# Altium schematic sheet STM32G473CET6_PINOUT.SchDoc
size C; SheetNumber: 9; SheetTotal: 12
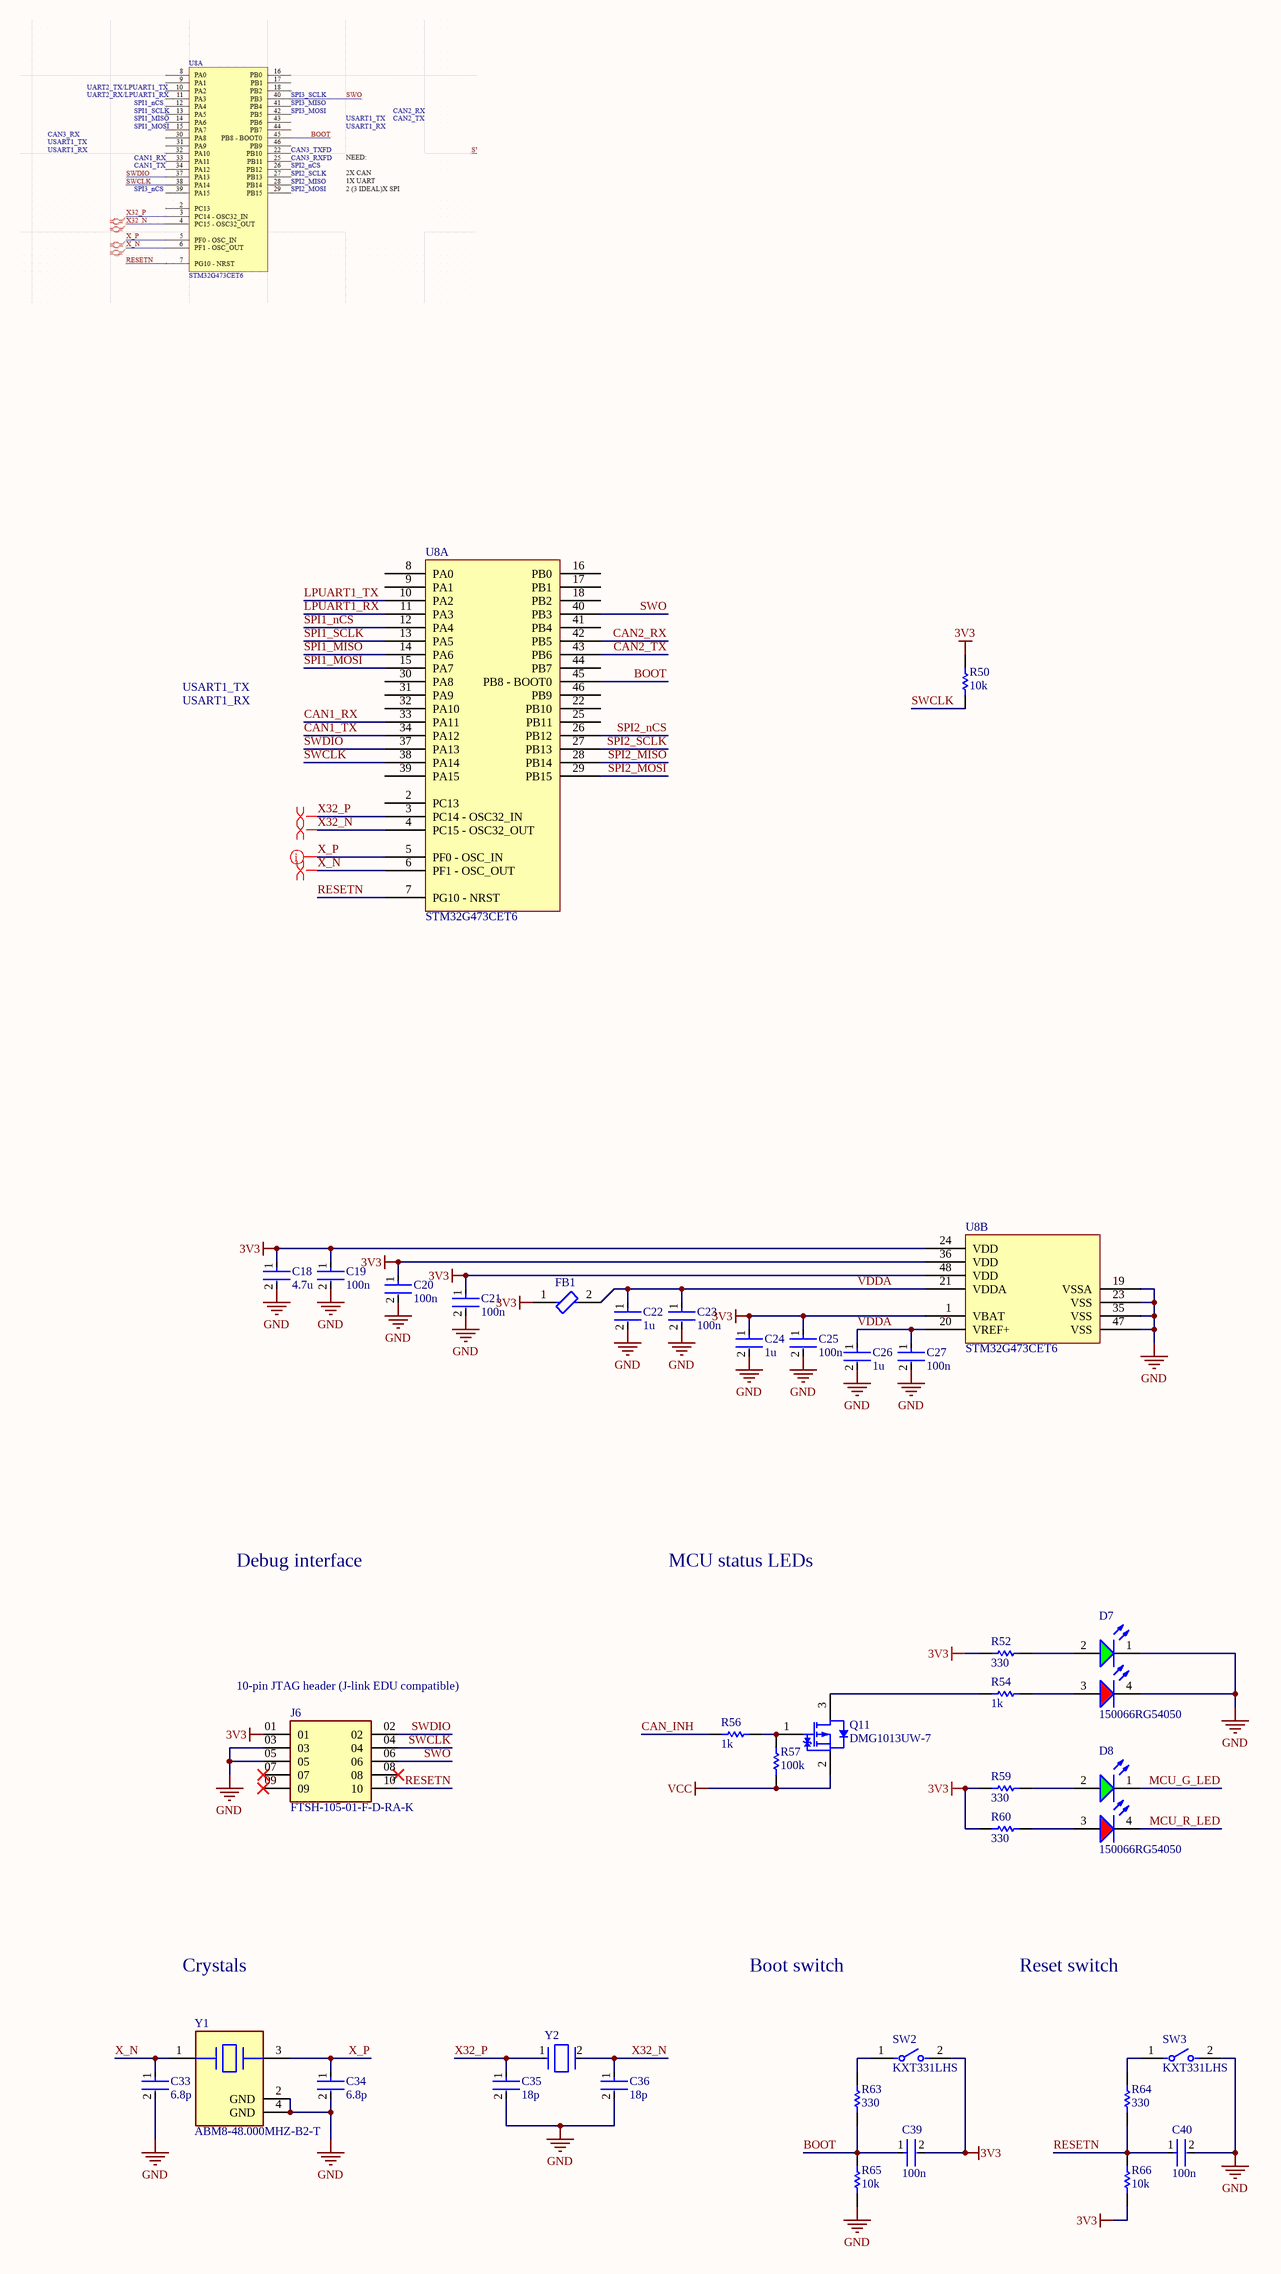
[diagram p0: STM32G473CET6_PINOUT.SchDoc]

## Parts
C18  4.7u  [FP-0402-L_1_0_0_05-W_0_5-IPC_A]
C19  100n  [FP-0402-L_1_0_0_05-W_0_5-IPC_A]
C20  100n  [FP-0402-L_1_0_0_05-W_0_5-IPC_A]
C21  100n  [FP-0402-L_1_0_0_05-W_0_5-IPC_A]
C22  1u  [FP-0402-L_1_0_0_05-W_0_5-IPC_A]
C23  100n  [FP-0402-L_1_0_0_05-W_0_5-IPC_A]
C24  1u  [FP-0402-L_1_0_0_05-W_0_5-IPC_A]
C25  100n  [FP-0402-L_1_0_0_05-W_0_5-IPC_A]
C26  1u  [FP-0402-L_1_0_0_05-W_0_5-IPC_A]
C27  100n  [FP-0402-L_1_0_0_05-W_0_5-IPC_A]
C33  6.8p  [FP-0402-L_1_0_0_05-W_0_5-IPC_A]
C34  6.8p  [FP-0402-L_1_0_0_05-W_0_5-IPC_A]
C35  18p  [FP-0402-L_1_0_0_05-W_0_5-IPC_A]
C36  18p  [FP-0402-L_1_0_0_05-W_0_5-IPC_A]
C39  100n  [FP-0402-L_1_0_0_05-W_0_5-IPC_A]
C40  100n  [FP-0402-L_1_0_0_05-W_0_5-IPC_A]
D7  150066RG54050  [WL-SBCD_0606]
D8  150066RG54050  [WL-SBCD_0606]
FB1  BLM15PX601SN1D  [FP-BLM15-0_05-MFG]  (value not drawn)
J6  FTSH-105-01-F-D-RA-K  [FTSH-105-01-F-D-RA-K-Footprint-1]
Q11  DMG1013UW-7  [DIOD-SOT323-3_V]
R50  10k  [R0603B]
R52  330  [R0603B]
R54  1k  [R0603B]
R56  1k  [R0603B]
R57  100k  [R0603B]
R59  330  [R0603B]
R60  330  [R0603B]
R63  330  [R0603B]
R64  330  [R0603B]
R65  10k  [R0603B]
R66  10k  [R0603B]
SW2  KXT331LHS  [FP-KXT331LHS-MFG]
SW3  KXT331LHS  [FP-KXT331LHS-MFG]
U8  STM32G473CET6  [TSQFP50P900X900X160-48N]  (parts A,B of 2)
Y1  ABM8-48.000MHZ-B2-T  [FP-ABM8-MFG]
Y2  ECS-.327-12.5-1210-TR  [FP-ECX-1210-MFG]  (value not drawn)

## Nets
3V3: C18.1 C19.1 C20.1 C21.1 C24.1 C25.1 C39.2 FB1.1 J6.01 R50.2 R52.2 R59.2 R60.2 R66.1 SW2.2 U8.1(VBAT) U8.24(VDD) U8.36(VDD) U8.48(VDD)
GND: C18.2 C19.2 C20.2 C21.2 C22.2 C23.2 C24.2 C25.2 C26.2 C27.2 C33.2 C34.2 C35.2 C36.2 C40.2 D7.1(K) D7.4(K) J6.03 J6.05 R65.1 SW3.2 U8.19(VSSA) U8.23(VSS) U8.35(VSS) U8.47(VSS) Y1.2(GND) Y1.4(GND)
VCC: Q11.2(S) R57.2
BOOT: C39.1 R63.1 R65.2 U8.45(PB8_-_BOOT0)
CAN1_RX: U8.33(PA11)
CAN1_TX: U8.34(PA12)
CAN2_RX: U8.42(PB5)
CAN2_TX: U8.43(PB6)
CAN_INH: R56.2
LPUART1_RX: U8.11(PA3)
LPUART1_TX: U8.10(PA2)
MCU_G_LED: D8.1(K)
MCU_R_LED: D8.4(K)
RESETN: C40.1 J6.10 R64.1 R66.2 U8.7(PG10_-_NRST)
SPI1_MISO: U8.14(PA6)
SPI1_MOSI: U8.15(PA7)
SPI1_nCS: U8.12(PA4)
SPI1_SCLK: U8.13(PA5)
SPI2_MISO: U8.28(PB14)
SPI2_MOSI: U8.29(PB15)
SPI2_nCS: U8.26(PB12)
SPI2_SCLK: U8.27(PB13)
SWCLK: J6.04 R50.1 U8.38(PA14)
SWDIO: J6.02 U8.37(PA13)
SWO: J6.06 U8.40(PB3)
VDDA: C22.1 C23.1 C26.1 C27.1 FB1.2 U8.20(VREF+) U8.21(VDDA)
X32_N: C36.1 U8.4(PC15_-_OSC32_OUT) Y2.2(Out/In)
X32_P: C35.1 U8.3(PC14_-_OSC32_IN) Y2.1(In/Out)
X_N: C33.1 U8.6(PF1_-_OSC_OUT) Y1.1
X_P: C34.1 U8.5(PF0_-_OSC_IN) Y1.3
NetD7_2: D7.2(A) R52.1
NetD7_3: D7.3(A) R54.1
NetD8_2: D8.2(A) R59.1
NetD8_3: D8.3(A) R60.1
NetQ11_1: Q11.1(G) R56.1 R57.1
NetQ11_3: Q11.3(D) R54.2
NetR63_2: R63.2 SW2.1
NetR64_2: R64.2 SW3.1

Not connected (* = marked no-connect by the designer): J6 07* 08* 09*; U8 2(PC13) 8(PA0) 9(PA1) 16(PB0) 17(PB1) 18(PB2) 22(PB10) 25(PB11) 30(PA8) 31(PA9) 32(PA10) 39(PA15) 41(PB4) 44(PB7) 46(PB9)

## Layout directives
differential pair: X32_N, X32_P, X_N, X_P

## Notes on the sheet
- USART1_TX
- USART1_RX
- Debug interface
- MCU status LEDs
- (near J6) 10-pin JTAG header (J-link EDU compatible)
- Crystals
- Boot switch
- Reset switch

## Library data of the parts
C18-C27 C33-C36 C39 C40 = CMP-001-00058-1: LARGE PADS, 0402 CAP, CHANGE COMMENT TO MATCH REAL P/N; Capacitor Type: Ceramic; Min Operating Temperature: -55°C; Mounting Technology: Surface Mount; Pins: 2; Case/Package: 0402; RoHS Compliant: Yes; Max Operating Temperature: 85°C
D7 D8 = CMP-004-00040-2: Led, Red/Grn, 180Mcd/230Mcd, 624Nm/525Nm Rohs Compliant: Yes; Source: rgled.SchLib; Component Type: Standard; Design Item ID: CMP-004-00034-2; Pins: 4
FB1 = CMP-0686-00252-4: Chip Ferrite Bead, 0402, 600Ω @ 100MHz, 0.23Ω, 25%, 900mA; Number of Circuits: 1; Impedance: 600R; DC Resistance (DCR): 230mR; Material: Steel; Length: 1mm; Package Quantity: 10000; Height: 0.5mm; Width: 0.5mm; Max DC Current: 900mA; Number of Lines: 1; Termination: SMD/SMT; Packaging: Tape and Reel; Lead Free: Lead Free; Min Operating Temperature: -55°C; Max Operating Temperature: 125°C; Max Current Rating: 900mA; Case Code (Imperial): 0402; Number of Pins: 2; Current Rating: 900mA; Test Frequency: 100MHz; Case/Package: 0402; Tolerance: 25%; Case Code (Metric): 1005
J6 = CMP-002-00041-5: Board Connector, 10 Contact(s), 2 Row(s), Male, Right Angle, 0.05 inch Pitch, Surface Mount Terminal, Locking, Black Insulator; Connector Type: BOARD CONNECTOR; Mounting Technology: Board; RoHS Compliant: Yes
Q11 = CMP-2000-06170-1: P-Channel Enhancement Mode MOSFET, 310 mW, 20 V, -55 to 150 degC, 3-Pin SOT-323, RoHS, Tape and Reel; Manufacturer: Diodes Inc; Qg Gate Charge: 0.622nC; Drain-Source On Resistance-Max: 750mO; Rated Power Dissipation: 310mW; Drain-to-Source Voltage [Vdss]: 20V; Package Reference: SOT323; Datasheet Version: Rev. 3-2, 09/2013; Package Description: 3-Pin Small Outline Transistor, Body 2 x 1.25 mm, Pitch 0.65 mm; Mounting Technology: SurfaceMount; Manufacturer URL: http://www.diodes.com/; Datasheet URL: http://www.diodes.com/_files/datasheets/ds31861.pdf; Channel Type: P-Channel
R50 R52 R54 R56 R57 R59 R60 R63-R66 = CMP-009-00002-14: Resistor
SW2 SW3 = CMP-10040-000029-1: SWITCH TACTILE SPST-NO 0.02A 15V; Operating Force: 240gf; Switch Travel: 0.13mm; Illumination Type: Non-Illuminated; Throw Configuration: SPST; Number of Ports: 1; Current Rating: 5A; Mechanical Life: 500000Cycles; Switch Function: Off-Mom; Connector Type: USB; Actuator Type: Standard; Gender: Receptacle; Number of Contacts: 24; Contact Plating: Gold; Insulation Color: Black; Min Operating Temperature: -40°C; Packaging: Tape and Reel; Flammability Rating: UL94 V-0; Max Operating Temperature: 85°C; Termination: Solder; Mount: Surface Mount
U8 = CMP-020-00018-2: RISC Microcontroller, 32-Bit, 170MHz; RoHS Compliant: Yes
Y1 = CMP-27762-011708-1: Crystal 48MHz ±20ppm 18pF SMD-4 3.2mm x 2.5mm; Series Resistance: 35R; Frequency Stability: 50ppm; Package Quantity: 1000; Packaging: Tape and Reel; Mount: Surface Mount; Length: 3.2mm; Load Capacitance: 18pF; Max Operating Temperature: 70°C; Operating Frequency: 48 MHz; RoHS Compliant: Yes; Series: ABM8; Frequency Tolerance: 20ppm; Lead Free: Lead Free; Min Operating Temperature: -20°C; Case/Package: CSMD; Number of Pins: 4; Height: 0.031inch; ESR (Equivalent Series Resistance): 35R; Frequency: 48MHz; Radiation Hardening: No; Width: 0.098inch; Tolerance: 20ppm; Termination: SMD/SMT; Depth: 2.5mm; Resistor Type: Ceramic; REACH SVHC: No SVHC
Y2 = CMP-40224-000006-1: CRYSTAL 32.7680KHZ 12.5PF SMD; Manufacturer: ECS International; Frequency: 32.768kHz; Esr: 90kΩ; Tolerance: 20ppm; Device Class L1: Passive Components; Load Capacitance: 12.5pF; Temperature: -40°C to +85°C; ComponentLink2URL: https://ecsxtal.com/store/pdf/ECX-1210.pdf; Series: ECX-1210; Octopart: https://octopart.com/ecs-.327-12.5-1210-tr-ecs+international-81221340; ComponentLink2Description: Datasheet; Temperature Range Low: -40°C; Digikey Description: CRYSTAL 32.7680KHZ 12.5PF SMD; Lead Free: Yes; RoHS: TRUE; Device Class L3: Crystals; Automotive: No; Category: Crys; Height: 0.5mm; Manufacturer Part Number: ECS-.327-12.5-1210-TR; Temperature Range High: +85°C; Device Class L2: Crystals / Oscillators; Package: ECX-1210